# Altium schematic sheet MCU.SchDoc
size Letter
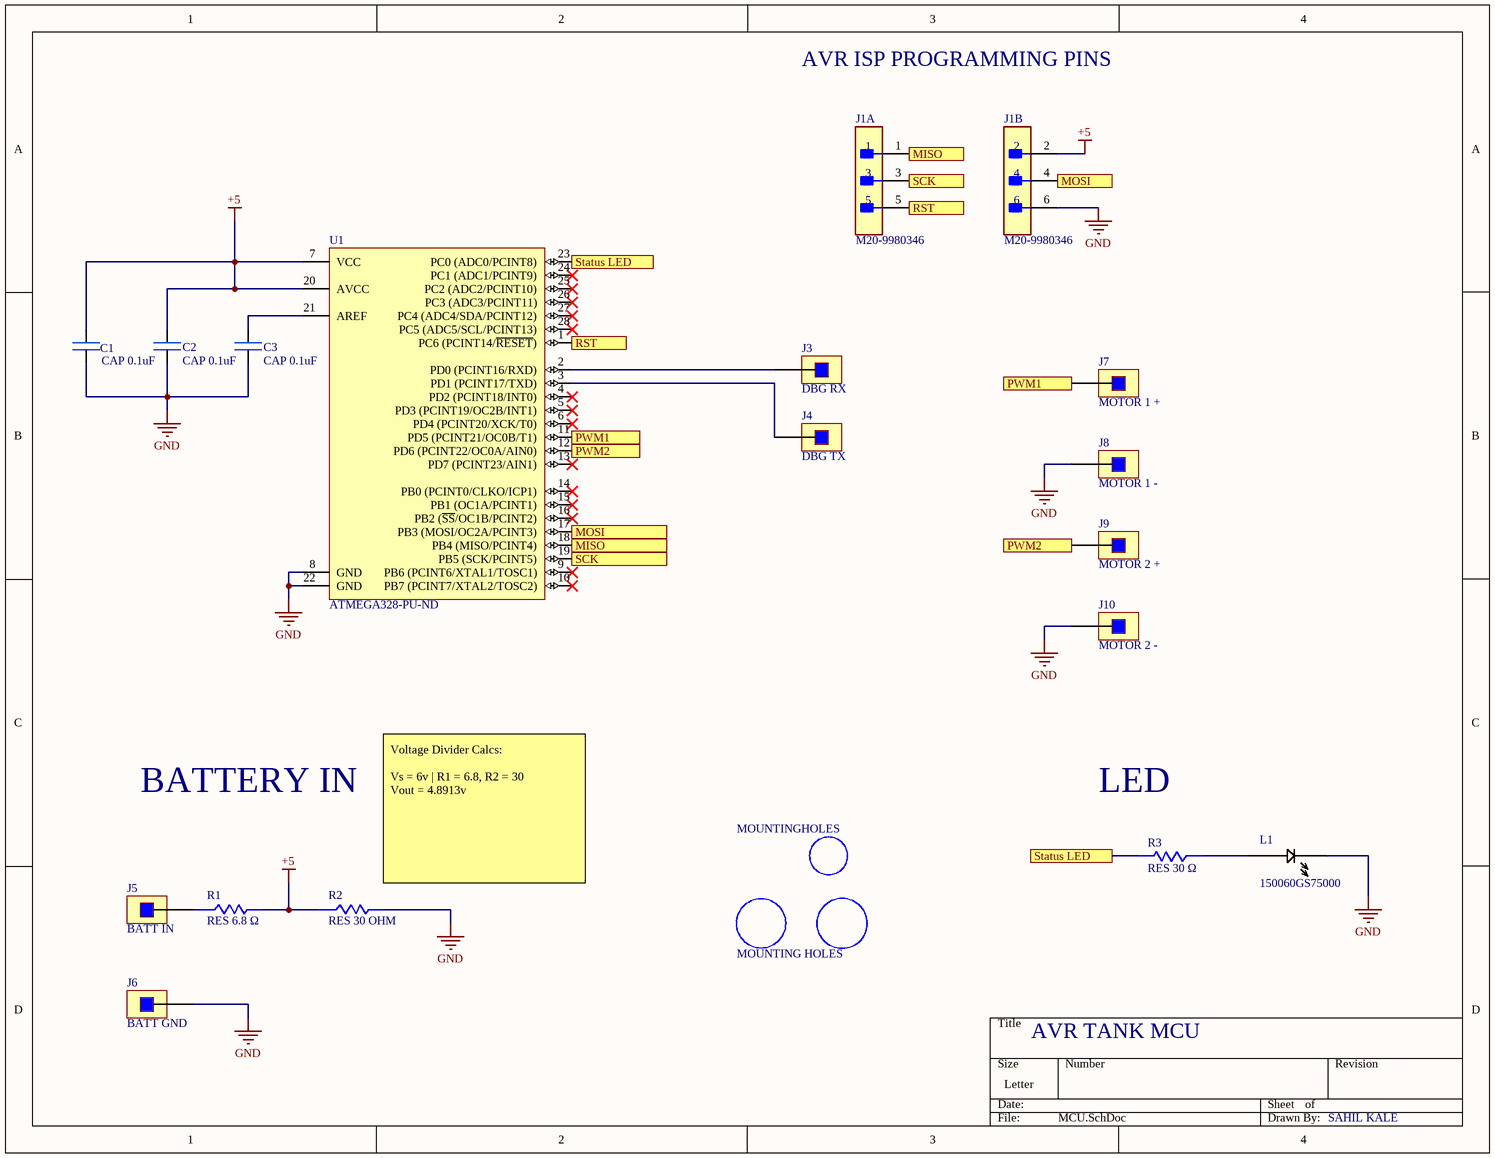
[diagram p0: MCU.SchDoc]

## Parts
C1  CAP 0.1uF  [CAP0.1uF]
C2  CAP 0.1uF  [CAP0.1uF]
C3  CAP 0.1uF  [CAP0.1uF]
J1  M20-9980346  [FP-M20-9980346-MFG]  (parts A,B of 2)
J3  DBG RX  [PIN_HEADER]
J4  DBG TX  [PIN_HEADER]
J5  BATT IN  [PIN_HEADER]
J6  BATT GND  [PIN_HEADER]
J7  MOTOR 1 +  [PIN_HEADER]
J8  MOTOR 1 -  [PIN_HEADER]
J9  MOTOR 2 +  [PIN_HEADER]
J10  MOTOR 2 -  [PIN_HEADER]
L1  150060GS75000  [150060GS75000]
MOUNTINGHOLES  MOUNTING HOLES  [MOUNTING HOLES]
R1  RES 6.8 Ω  [RES 6.8 OHM]
R2  RES 30 OHM  [RES 30 OHM]
R3  RES 30 Ω  [RES 30 OHM]
U1  Supplier Part Number 1: ATMEGA328-PU-ND  [ATMEGA328-PU]  (hidden comment: ATMEGA328-PU)

## Ports
MISO, MOSI, PWM1, PWM2, RST, SCK, Status LED

## Nets
+5: C1.1 C2.1 J1.2 R1.1 R2.2 U1.7(VCC) U1.20(AVCC)
GND: C1.2 C2.2 C3.2 J1.6 J6.1 J8.1 J10.1 L1.1(RED_-) R2.1 U1.8(GND) U1.22(GND)
MISO: J1.1 U1.18(PB4_(MISO/PCINT4)) ; port MISO
MOSI: J1.4 U1.17(PB3_(MOSI/OC2A/PCINT3)) ; port MOSI
PWM1: J7.1 U1.11(PD5_(PCINT21/OC0B/T1)) ; port PWM1
PWM2: J9.1 U1.12(PD6_(PCINT22/OC0A/AIN0)) ; port PWM2
RST: J1.5 U1.1(PC6_(PCINT14/~{RESET})) ; port RST
SCK: J1.3 U1.19(PB5_(SCK/PCINT5)) ; port SCK
Status LED: R3.1 U1.23(PC0_(ADC0/PCINT8)) ; port Status LED
NetC3_1: C3.1 U1.21(AREF)
NetJ3_1: J3.1 U1.2(PD0_(PCINT16/RXD))
NetJ4_1: J4.1 U1.3(PD1_(PCINT17/TXD))
NetJ5_1: J5.1 R1.2
NetL1_2: L1.2(Red_+) R3.2

Not connected (* = marked no-connect by the designer): U1 4(PD2_(PCINT18/INT0))* 5(PD3_(PCINT19/OC2B/INT1))* 6(PD4_(PCINT20/XCK/T0))* 9(PB6_(PCINT6/XTAL1/TOSC1))* 10(PB7_(PCINT7/XTAL2/TOSC2))* 13(PD7_(PCINT23/AIN1))* 14(PB0_(PCINT0/CLKO/ICP1))* 15(PB1_(OC1A/PCINT1))* 16(PB2_(~{SS}/OC1B/PCINT2))* 24(PC1_(ADC1/PCINT9))* 25(PC2_(ADC2/PCINT10))* 26(PC3_(ADC3/PCINT11))* 27(PC4_(ADC4/SDA/PCINT12))* 28(PC5_(ADC5/SCL/PCINT13))*

## Notes on the sheet
- AVR ISP PROGRAMMING PINS
- BATTERY IN
- LED
- (near R2) Voltage Divider Calcs:
  Vs = 6v | R1 = 6.8, R2 = 30
  Vout = 4.8913v
- AVR TANK MCU
- SAHIL KALE

## Library data of the parts
C1-C3 = CAP 0.1uF: Ceramic Capacitor, Multilayer, Ceramic, 16V, 10% +Tol, 10% -Tol, X7R, 15% TC, 0.1uF, Surface Mount, 0402; Manufacturer: Murata; Manufacturer Part Number: GRM155R71C104KA88D; Capacitance: 100nF; Multilayer: Yes; Supplier 1: Digi-Key; RoHS: Yes; Category: Ceramic Capacitors; Stock 1: 19996896; Pricing 1: 1=0.10000, 10=0.02100, 50=0.01140, 100=0.00930, 500=0.00666, 1000=0.00523, 2500=0.00476, 5000=0.00438 (USD); Mount: Surface Mount; Number of Pins: 2; Dielectric Material: Ceramic; Size Code: 0402; Terminal Finish: Nickel; Package Shape: Rectangular; Min Operating Temperature: -55°C; Max Operating Temperature: 125°C; JESD-609 Code: e3; Capacitor Type: Ceramic; Negative Tolerance: 10%; Packaging: Tape and Reel; Positive Tolerance: 10%; Rated DC Voltage (URdc): 16V; Temperature Characteristics Code: X7R; Termination: Wraparound; Package Style: SMTMeter; Length: 1mm; Width: 0.5mm; ComponentLink1URL: https://psearch.en.murata.com:443/capacitor/product/GRM155R71C104KA88%23.pdf?src-supplier=IHS+Markit; ComponentLink1Description: https://psearch.en.murata.com:443/capacitor/product/GRM155R71C104KA88%23.pdf?src-supplier=IHS+Markit; ComponentLink2URL: https://datasheet.ciiva.com/129/grm155r71c104ka88-01-129740.pdf?src-supplier=Digi-Key; ComponentLink2Description: https://datasheet.ciiva.com/129/grm155r71c104ka88-01-129740.pdf?src-supplier=Digi-Key; ComponentLink3URL: https://datasheet.ciiva.com/18102/getdatasheetpartid-85307-18102905.pdf?src-supplier=Verical; ComponentLink3Description: https://datasheet.ciiva.com/18102/getdatasheetpartid-85307-18102905.pdf?src-supplier=Verical; ComponentLink4URL: https://datasheet.ciiva.com/129/grm155r71c104ka88-01-129739.pdf?src-supplier=Digi-Key; ComponentLink4Description: https://datasheet.ciiva.com/129/grm155r71c104ka88-01-129739.pdf?src-supplier=Digi-Key; ComponentLink5URL: https://datasheet.ciiva.com/29199/454098-da-01-en-vs-kondensator-0402-29199799.pdf?src-supplier=Conrad; ComponentLink5Description: https://datasheet.ciiva.com/29199/454098-da-01-en-vs-kondensator-0402-29199799.pdf?src-supplier=Conrad; ComponentLink6URL: https://datasheet.ciiva.com/28534/4360-28534133.pdf?src-supplier=Element14; ComponentLink6Description: https://datasheet.ciiva.com/28534/4360-28534133.pdf?src-supplier=Element14; ComponentLink7URL: https://datasheet.ciiva.com/14103/grmseries-highdielectrictype-eng-14103750.pdf?src-supplier=Distrelec; ComponentLink7Description: https://datasheet.ciiva.com/14103/grmseries-highdielectrictype-eng-14103750.pdf?src-supplier=Distrelec; ComponentLink8URL: https://datasheet.ciiva.com/16199/product-16199000.pdf?src-supplier=Future+Electronics; ComponentLink8Description: https://datasheet.ciiva.com/16199/product-16199000.pdf?src-supplier=Future+Electronics; ComponentLink9URL: https://datasheet.ciiva.com/14116/grmseries-highdielectrictype-eng-14116878.pdf?src-supplier=Distrelec; ComponentLink9Description: https://datasheet.ciiva.com/14116/grmseries-highdielectrictype-eng-14116878.pdf?src-supplier=Distrelec; ComponentLink10URL: https://datasheet.ciiva.com/7937/4360-7937615.pdf?src-supplier=Element14; ComponentLink10Description: https://datasheet.ciiva.com/7937/4360-7937615.pdf?src-supplier=Element14; ComponentLink11URL: https://datasheet.ciiva.com/28534/4360-28534127.pdf?src-supplier=Element14; ComponentLink11Description: https://datasheet.ciiva.com/28534/4360-28534127.pdf?src-supplier=Element14; Height: 0.5mm; Supplier Part Number 1: 490-3261-1-ND
J1 = CMP-2000-06636-2: CONN HEADER VERT 6POS 2.54MM; Manufacturer: Harwin; Current Rating: 3A; Number Of Contacts: 6; Conn Gender: Male; Conn Orientation: Vertical; Description: 2.54mm Pitch 6 Way 2 Row Straight PCB Header, Solder Termination, 3A; Device Class L1: Connectors; ComponentLink2Description: Datasheet; Height: 8.99mm; Temperature Range High: +105°C; Contact Material: Tin,Nickel; RoHS: TRUE; Temperature Range Low: -40°C; ComponentLink2URL: https://cdn.harwin.com/pdfs/M20-998.pdf; Digikey Description: CONN HEADER VERT 6POS 2.54MM; Pitch: 2.54mm; Package: M20-9980346; Device Class L2: Headers and Wire Housings; Manufacturer Part Number: M20-9980346; Number Of Rows: 2; Category: Conn; Lead Free: Yes; Mouser Description: 2.54mm (0.1") Pitch DIL Vertical PC Tail Pin Header, 6.1mm mating pin height, tin, 3+3 contacts; Temperature: -40°C to +105°C; Device Class L3: unset; Octopart: https://octopart.com/m20-9980346-harwin-5436545; Automotive: No
J3-J10 = PIN_HEADER: Board Connector, 1 Contact(s), 1 Row(s), Male, Straight, Solder Terminal; Manufacturer: Sullins; Manufacturer Part Number: PREC001SAAN-RC; Option: General Purpose; Filter Feature: No; Number of Rows Loaded: 1; Supplier 1: Digi-Key; RoHS: Yes; Category: Connectors; Stock 1: 16681; Pricing 1: 1=0.04000, 10=0.03000, 25=0.02800, 50=0.02080, 100=0.01780, 250=0.01724, 500=0.01486 (USD); Mount: Board; Connector Type: BOARD CONNECTOR; Contact Gender: Male; Mixed Contacts: No; Mounting Style: STRAIGHT; Termination: Solder; Number of Contacts: 1; Flammability Rating: UL94 V-0; DIN Conformance: No; IEC Conformance: No; MIL Conformance: No; ComponentLink1URL: https://datasheet.ciiva.com:443/pdfs/VipMasterIC/IC/SUCS/SUCS-S-A0005121173/SUCS-S-A0005121173-1.pdf?src-supplier=IHS+Markit; ComponentLink1Description: https://datasheet.ciiva.com:443/pdfs/VipMasterIC/IC/SUCS/SUCS-S-A0005121173/SUCS-S-A0005121173-1.pdf?src-supplier=IHS+Markit; ComponentLink2URL: https://datasheet.ciiva.com/740/zrzczzzszzn-rc-st-11635-b-740844.pdf?src-supplier=Digi-Key; ComponentLink2Description: https://datasheet.ciiva.com/740/zrzczzzszzn-rc-st-11635-b-740844.pdf?src-supplier=Digi-Key; Supplier Part Number 1: S1012EC-01-ND
L1 = LED Orange SMD: Single Color LED, Green, Water Clear, 1.1mm; Manufacturer: Wurth Electronics; Shape: Rectangular; Forward Current-Max: 30mA; Luminous Intensity-Nom: 430mcd; Number of Functions: 1; Viewing Angle: 140°; Overall Height: 0.7mm; Supplier 1: Digi-Key; Manufacturer Part Number: 150060GS75000; RoHS: Yes; Category: LEDs; Stock 1: 86159; Pricing 1: 1=0.14000, 50=0.13300, 100=0.11400, 500=0.09900 (USD); Mount: Surface Mount; Number of Pins: 2; Color: Green; Min Operating Temperature: -40°C; Max Operating Temperature: 85°C; Lens Style: WATER CLEAR; Optoelectronic Device Type: SINGLE COLOR LED; Packaging: Tape and Reel; Size: 1.1mm; Terminal Pitch: 1.6mm; ComponentLink1URL: https://datasheet.ciiva.com:443/pdfs/VipMasterIC/IC/MIDC/MIDC-S-A0007790169/MIDC-S-A0007790169-1.pdf?src-supplier=IHS+Markit; ComponentLink1Description: https://datasheet.ciiva.com:443/pdfs/VipMasterIC/IC/MIDC/MIDC-S-A0007790169/MIDC-S-A0007790169-1.pdf?src-supplier=IHS+Markit; ComponentLink2URL: https://datasheet.ciiva.com/29562/150060gs75000-29562868.pdf?src-supplier=Digi-Key; ComponentLink2Description: https://datasheet.ciiva.com/29562/150060gs75000-29562868.pdf?src-supplier=Digi-Key; ComponentLink3URL: https://datasheet.ciiva.com/29279/759427-da-01-en-chipled-0603-w-kl-gruen-150060gs75000-29279201.pdf?src-supplier=Conrad; ComponentLink3Description: https://datasheet.ciiva.com/29279/759427-da-01-en-chipled-0603-w-kl-gruen-150060gs75000-29279201.pdf?src-supplier=Conrad; ComponentLink4URL: https://datasheet.ciiva.com/29562/150060gs75000-29562869.pdf?src-supplier=Digi-Key; ComponentLink4Description: https://datasheet.ciiva.com/29562/150060gs75000-29562869.pdf?src-supplier=Digi-Key; ComponentLink5URL: https://datasheet.ciiva.com/29562/150060gs75000-29562870.pdf?src-supplier=Digi-Key; ComponentLink5Description: https://datasheet.ciiva.com/29562/150060gs75000-29562870.pdf?src-supplier=Digi-Key; Supplier Part Number 1: 732-4971-1-ND
R1 = RES 6.8 Ω: Fixed Resistor, Metal Glaze/thick Film, 0.25W, 6.8ohm, 200V, 5% +/-Tol, 200ppm/Cel, Surface Mount, 1206; Manufacturer: Stackpole Electronics; Manufacturer Part Number: RMCF1206JT6R80; Rated Power Dissipation (P): 250mW; Rated Temperature: 70°C; Resistance: 6.8R; Temperature Coefficient: 200ppm/°C; Package Height: 0.55mm; Package Length: 3.2mm; Package Width: 1.6mm; Reference Standard: AEC-Q200; Supplier 1: Digi-Key; RoHS: Yes; Category: Chip SMD Resistors; Stock 1: 965; Pricing 1: 1=0.10000, 10=0.02900, 100=0.01180, 1000=0.00530, 2500=0.00460 (USD); Mount: Surface Mount; Number of Pins: 2; Package Shape: Rectangular; Size Code: 1206; Terminal Finish: Nickel; Min Operating Temperature: -55°C; Max Operating Temperature: 155°C; Tolerance: 5%; JESD-609 Code: e3; Resistor Type: FIXED RESISTOR; Construction: Rectangular; Package Style: SMTMeter; Packaging: Tape and Reel; Technology: METAL GLAZE/THICK FILM; Termination: Wraparound; Working Voltage: 200V; ComponentLink1URL: https://datasheet.ciiva.com:443/pdfs/VipMasterIC/IC/SEIE/SEIE-S-A0009541969/SEIE-S-A0009541969-1.pdf?src-supplier=IHS+Markit; ComponentLink1Description: https://datasheet.ciiva.com:443/pdfs/VipMasterIC/IC/SEIE/SEIE-S-A0009541969/SEIE-S-A0009541969-1.pdf?src-supplier=IHS+Markit; ComponentLink2URL: http://components.arrow.com/part/dataview/44988312S9337764N1174?src-supplier=Arrow+Electronics; ComponentLink2Description: http://components.arrow.com/part/dataview/44988312S9337764N1174?src-supplier=Arrow+Electronics; ComponentLink3URL: https://www.verical.com/server-webapp/html/getDatasheet?partID=365394&src-supplier=Verical; ComponentLink3Description: https://www.verical.com/server-webapp/html/getDatasheet?partID=365394&src-supplier=Verical; ComponentLink4URL: https://www.seielect.com/catalog/SEI-RMCF_RMCP.pdf?src-supplier=Avnet; ComponentLink4Description: https://www.seielect.com/catalog/SEI-RMCF_RMCP.pdf?src-supplier=Avnet; ComponentLink5URL: http://www.seielect.com/Catalog/SEI-RMCF_RMCP.pdf?src-supplier=Digi-Key; ComponentLink5Description: http://www.seielect.com/Catalog/SEI-RMCF_RMCP.pdf?src-supplier=Digi-Key; ComponentLink6URL: https://www.seielect.com/Catalog/SEI-RMCF_RMCP.pdf?src-supplier=Digi-Key; ComponentLink6Description: https://www.seielect.com/Catalog/SEI-RMCF_RMCP.pdf?src-supplier=Digi-Key; ComponentLink7URL: https://www.seielect.com/catalog/SEI-Packaging.pdf?src-supplier=Digi-Key; ComponentLink7Description: https://www.seielect.com/catalog/SEI-Packaging.pdf?src-supplier=Digi-Key; Supplier Part Number 1: RMCF1206JT6R80CT-ND
R2 = RES 30 OHM: Fixed Resistor, Metal Glaze/thick Film, 0.125W, 30ohm, 150V, 1% +/-Tol, 100ppm/Cel, Surface Mount, 0805; Manufacturer: Vishay Dale; Manufacturer Part Number: CRCW080530R0FKEAC; Rated Power Dissipation (P): 125mW; Resistance: 30R; Temperature Coefficient: -100100ppm/°C; Package Width: 1.25mm; Package Height: 0.5mm; Package Length: 2mm; Supplier 1: Digi-Key; RoHS: No; Stock 1: 71663; Pricing 1: 1=0.10000, 10=0.05400, 100=0.02210, 1000=0.00994, 2500=0.00862 (USD); Number of Pins: 2; Size Code: 0805; Terminal Finish: Nickel; Min Operating Temperature: -55°C; Max Operating Temperature: 155°C; Tolerance: 1%; Packaging: Tape and Reel; Technology: METAL GLAZE/THICK FILM; Working Voltage: 150V; JESD-609 Code: e3; Resistor Type: FIXED RESISTOR; Construction: Chip; Package Style: SMTMeter; ComponentLink1URL: https://datasheet.ciiva.com:443/pdfs/VipMasterIC/IC/VISH/VISH-S-A0003599164/VISH-S-A0003599164-1.pdf?src-supplier=IHS+Markit; ComponentLink1Description: https://datasheet.ciiva.com:443/pdfs/VipMasterIC/IC/VISH/VISH-S-A0003599164/VISH-S-A0003599164-1.pdf?src-supplier=IHS+Markit; Supplier Part Number 1: 541-4153-1-ND
R3 = RES 30 Ω: Fixed Resistor, Metal Glaze/thick Film, 0.125W, 30ohm, 150V, 1% +/-Tol, 100ppm/Cel, Surface Mount, 0805; Manufacturer: Vishay Dale; Manufacturer Part Number: CRCW080530R0FKEAC; Rated Power Dissipation (P): 125mW; Resistance: 30R; Temperature Coefficient: -100100ppm/°C; Package Width: 1.25mm; Package Height: 0.5mm; Package Length: 2mm; Supplier 1: Digi-Key; RoHS: No; Stock 1: 71663; Pricing 1: 1=0.10000, 10=0.05400, 100=0.02210, 1000=0.00994, 2500=0.00862 (USD); Number of Pins: 2; Size Code: 0805; Terminal Finish: Nickel; Min Operating Temperature: -55°C; Max Operating Temperature: 155°C; Tolerance: 1%; Packaging: Tape and Reel; Technology: METAL GLAZE/THICK FILM; Working Voltage: 150V; JESD-609 Code: e3; Resistor Type: FIXED RESISTOR; Construction: Chip; Package Style: SMTMeter; ComponentLink1URL: https://datasheet.ciiva.com:443/pdfs/VipMasterIC/IC/VISH/VISH-S-A0003599164/VISH-S-A0003599164-1.pdf?src-supplier=IHS+Markit; ComponentLink1Description: https://datasheet.ciiva.com:443/pdfs/VipMasterIC/IC/VISH/VISH-S-A0003599164/VISH-S-A0003599164-1.pdf?src-supplier=IHS+Markit; Supplier Part Number 1: 541-4153-1-ND
U1 = ATMEGA328-PU: RISC Microcontroller, 8-Bit, FLASH, AVR RISC CPU, 20MHz, CMOS, PDIP28; Manufacturer: Microchip / Atmel; Package Body Material: Plastic; Speed: 20RPM; Max Supply Current: 12mA; Max Supply Voltage: 5.5V; Min Supply Voltage: 4.5V; Supply Voltage-Nom: 5V; Surface Mount: No; Number of I/O Lines: 23; Power Supplies: 2.5V; Package Equivalence Code: DIP28,.3; Qualification Status: Not Qualified; Supplier 1: Digi-Key; Manufacturer Part Number: ATMEGA328-PU; RoHS: Yes; Category: Microcontrollers; Stock 1: 2722; Pricing 1: 1=1.90000, 25=1.74000, 100=1.58000 (USD); Package Code: DIP; Number of Pins: 28; Package Shape: Rectangular; Min Operating Temperature: -40°C; Max Operating Temperature: 85°C; Technology: CMOS; Terminal Form: Through Hole; Terminal Position: DUAL; Max Frequency: 20MHz; Package Style: IN-LINEMeter; JESD-30 Code: R-PDIP-T28; Length: 34.671mm; Width: 7.62mm; Terminal Pitch: 2.54mm; Height - Seated (Max): 4.5724mm; Temperature Grade: INDUSTRIAL; ComponentLink1URL: https://datasheet.ciiva.com:443/pdfs/VipMasterIC/IC/ATML/ATML-S-A0002642585/ATML-S-A0002642585-1.pdf?src-supplier=IHS+Markit; ComponentLink1Description: https://datasheet.ciiva.com:443/pdfs/VipMasterIC/IC/ATML/ATML-S-A0002642585/ATML-S-A0002642585-1.pdf?src-supplier=IHS+Markit; ComponentLink2URL: https://datasheet.ciiva.com/20168/73-4281-20168377.pdf?src-supplier=Rapid+Electronics; ComponentLink2Description: https://datasheet.ciiva.com/20168/73-4281-20168377.pdf?src-supplier=Rapid+Electronics; ComponentLink3URL: https://datasheet.ciiva.com/1157/1684409-1157692.pdf?src-supplier=Element14; ComponentLink3Description: https://datasheet.ciiva.com/1157/1684409-1157692.pdf?src-supplier=Element14